# EAGLE design circuitPendulumLEDs (EAGLE 6.6.0)
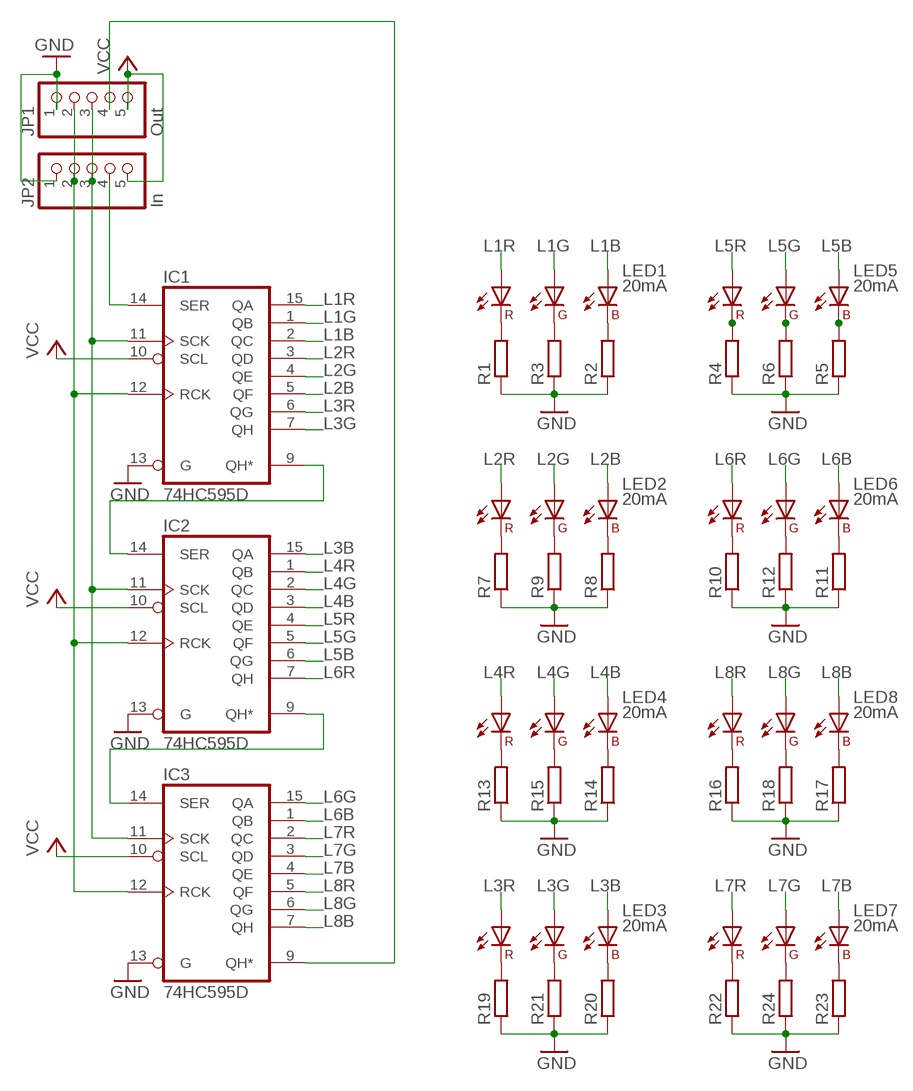
[diagram p0: schematic, sheet 1]

## Parts
IC1  74HC595D  [SO16]
IC2  74HC595D  [SO16]
IC3  74HC595D  [SO16]
JP1  Out  PINHD-1X55X2MM  [1_05X2MM]
JP2  In  PINHD-1X55X2MM  [1_05X2MM]
LED1  20mA  PLCC-6-RGB-SAMSUNG  [PLCC-6_SAMSUNG]
LED2  20mA  PLCC-6-RGB-SAMSUNG  [PLCC-6_SAMSUNG]
LED3  20mA  PLCC-6-RGB-SAMSUNG  [PLCC-6_SAMSUNG]
LED4  20mA  PLCC-6-RGB-SAMSUNG  [PLCC-6_SAMSUNG]
LED5  20mA  PLCC-6-RGB-SAMSUNG  [PLCC-6_SAMSUNG]
LED6  20mA  PLCC-6-RGB-SAMSUNG  [PLCC-6_SAMSUNG]
LED7  20mA  PLCC-6-RGB-SAMSUNG  [PLCC-6_SAMSUNG]
LED8  20mA  PLCC-6-RGB-SAMSUNG  [PLCC-6_SAMSUNG]
R1  R-EU_R0603  [R0603]
R2  R-EU_R0603  [R0603]
R3  R-EU_R0603  [R0603]
R4  R-EU_R0603  [R0603]
R5  R-EU_R0603  [R0603]
R6  R-EU_R0603  [R0603]
R7  R-EU_R0603  [R0603]
R8  R-EU_R0603  [R0603]
R9  R-EU_R0603  [R0603]
R10  R-EU_R0603  [R0603]
R11  R-EU_R0603  [R0603]
R12  R-EU_R0603  [R0603]
R13  R-EU_R0603  [R0603]
R14  R-EU_R0603  [R0603]
R15  R-EU_R0603  [R0603]
R16  R-EU_R0603  [R0603]
R17  R-EU_R0603  [R0603]
R18  R-EU_R0603  [R0603]
R19  R-EU_R0603  [R0603]
R20  R-EU_R0603  [R0603]
R21  R-EU_R0603  [R0603]
R22  R-EU_R0603  [R0603]
R23  R-EU_R0603  [R0603]
R24  R-EU_R0603  [R0603]

## Nets
GND: IC1.13(G) IC2.13(G) IC3.13(G) JP1.1 JP2.1 R1.1 R2.1 R3.1 R4.1 R5.1 R6.1 R7.1 R8.1 R9.1 R10.1 R11.1 R12.1 R13.1 R14.1 R15.1 R16.1 R17.1 R18.1 R19.1 R20.1 R21.1 R22.1 R23.1 R24.1
L1B: IC1.2(QC) LED1.3(AB)
L1G: IC1.1(QB) LED1.2(AG)
L1R: IC1.15(QA) LED1.1(AR)
L2B: IC1.5(QF) LED2.3(AB)
L2G: IC1.4(QE) LED2.2(AG)
L2R: IC1.3(QD) LED2.1(AR)
L3B: IC2.15(QA) LED3.3(AB)
L3G: IC1.7(QH) LED3.2(AG)
L3R: IC1.6(QG) LED3.1(AR)
L4B: IC2.3(QD) LED4.3(AB)
L4G: IC2.2(QC) LED4.2(AG)
L4R: IC2.1(QB) LED4.1(AR)
L5B: IC2.6(QG) LED5.3(AB)
L5G: IC2.5(QF) LED5.2(AG)
L5R: IC2.4(QE) LED5.1(AR)
L6B: IC3.1(QB) LED6.3(AB)
L6G: IC3.15(QA) LED6.2(AG)
L6R: IC2.7(QH) LED6.1(AR)
L7B: IC3.4(QE) LED7.3(AB)
L7G: IC3.3(QD) LED7.2(AG)
L7R: IC3.2(QC) LED7.1(AR)
L8B: IC3.7(QH) LED8.3(AB)
L8G: IC3.6(QG) LED8.2(AG)
L8R: IC3.5(QF) LED8.1(AR)
N$2: LED1.4(CR) R1.2
N$3: LED1.6(CB) R2.2
N$4: LED1.5(CG) R3.2
N$5: LED5.4(CR) R4.2
N$6: LED5.6(CB) R5.2
N$7: LED5.5(CG) R6.2
N$8: LED4.4(CR) R13.2
N$9: IC1.9(QH*) IC2.14(SER)
N$10: LED4.6(CB) R14.2
N$11: LED4.5(CG) R15.2
N$12: LED8.4(CR) R16.2
N$13: LED8.6(CB) R17.2
N$14: IC1.14(SER) JP2.4
N$15: IC2.9(QH*) IC3.14(SER)
N$16: LED8.5(CG) R18.2
N$17: LED6.4(CR) R10.2
N$18: LED6.6(CB) R11.2
N$19: LED6.5(CG) R12.2
N$20: LED2.4(CR) R7.2
N$21: IC3.9(QH*) JP1.4
N$22: LED2.6(CB) R8.2
N$23: IC1.12(RCK) IC2.12(RCK) IC3.12(RCK) JP1.2 JP2.2
N$24: LED2.5(CG) R9.2
N$25: IC1.11(SCK) IC2.11(SCK) IC3.11(SCK) JP1.3 JP2.3
N$26: LED3.4(CR) R19.2
N$27: LED3.6(CB) R20.2
N$28: LED3.5(CG) R21.2
N$29: LED7.4(CR) R22.2
N$30: LED7.6(CB) R23.2
N$31: LED7.5(CG) R24.2
VCC: IC1.10(SCL) IC2.10(SCL) IC3.10(SCL) JP1.5 JP2.5

## Power pins joined to a net without a drawn wire
GND: IC1.8(GND) IC2.8(GND) IC3.8(GND)
VCC: IC1.16(VCC) IC2.16(VCC) IC3.16(VCC)

## Library data of the parts
IC1-IC3 = 74xx-eu:74*595: 8-bit SHIFT REGISTER, output latch
JP1 JP2 = pinhead:PINHD-1X5: PIN HEADER
LED1-LED8 = LED-Samsung-RGB:PLCC-6-RGB-SAMSUNG
R1-R24 = resistor:R-EU_: RESISTOR, European symbol

## Board
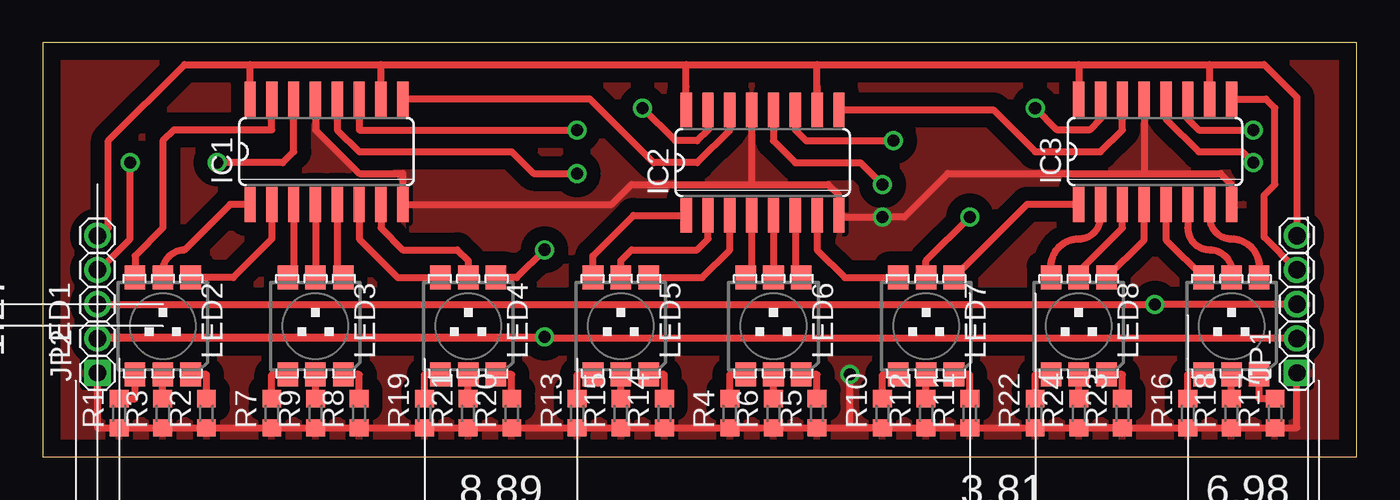
[diagram p1: board, top side]
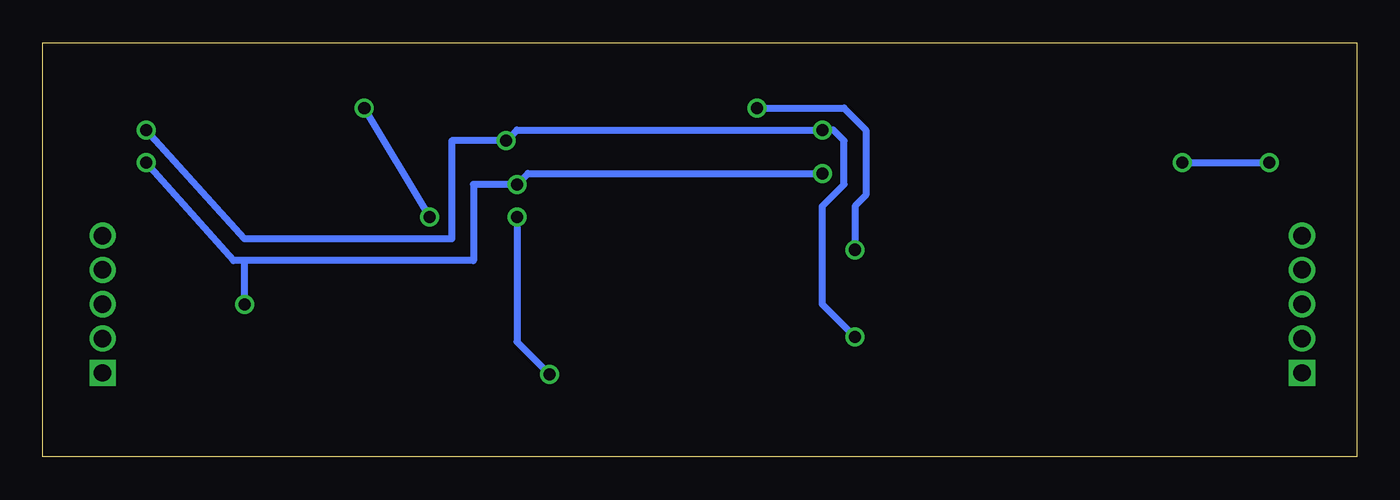
[diagram p2: board, bottom side, seen from below]

Size 76.51 x 24.12 mm. Coordinates in mm from the lower left corner, seen from the top.
Outline: 0,0 76.51,0 76.51,24.12 0,24.12 0,0
Copper layers (1*16): Top 0.035mm / dielectric 1.5mm / Bottom 0.035mm
Design rules "default": minimum track width 10mil, minimum drill 24mil, track to track 8mil, track to pad 8mil, pad to pad 8mil, via to via 8mil, smd to smd 8mil, copper to edge 40mil, drill to drill 8mil, minimum pad ring 10mil, minimum via ring 8mil, stop-mask expansion 4mil, vias tented up to drill 0mil, thermal gap 10mil

### Footprints (pad centres in the part's own frame; a part is rotated, then mirrored left to right if it is on the bottom)
SO16 = smd 0.66 x 2.032: 1 -4.445,-3.073; 2 -3.175,-3.073; 3 -1.905,-3.073; 4 -0.635,-3.073; 5 0.635,-3.073; 6 1.905,-3.073; 7 3.175,-3.073; 8 4.445,-3.073; 9 4.445,3.073; 10 3.175,3.073; 11 1.905,3.073; 12 0.635,3.073; 13 -0.635,3.073; 14 -1.905,3.073; 15 -3.175,3.073; 16 -4.445,3.073
1_05X2MM = drill 1.016 pad 1.3 square: 1 -4,0 | drill 1.016 pad 1.3: 2 0,0; 3 -2,0; 4 2,0; 5 4,0
PLCC-6_SAMSUNG = smd 1.2 x 1.4: 1 -1.619,2.826; 2 0,2.826; 3 1.619,2.826; 4 -1.619,-2.826; 5 0,-2.826; 6 1.619,-2.826
R0603 = smd 1 x 1.1: 1 -0.85,0; 2 0.85,0

### Placement (x,y rotation side)
IC1  16.51,17.78 0 top
IC2  41.91,17.15 0 top
IC3  64.77,17.78 0 top
JP1  73.03,8.89 90 top
JP2  3.17,8.89 90 top
LED1  6.98,7.62 0 top
LED2  15.88,7.62 0 top
LED3  24.77,7.62 0 top
LED4  33.66,7.62 0 top
LED5  42.54,7.62 0 top
LED6  51.43,7.62 0 top
LED7  60.32,7.62 0 top
LED8  69.22,7.62 0 top
R1  4.45,2.54 90 top
R2  9.53,2.54 90 top
R3  6.98,2.54 90 top
R4  40,2.54 90 top
R5  45.09,2.54 90 top
R6  42.54,2.54 90 top
R7  13.33,2.54 90 top
R8  18.42,2.54 90 top
R9  15.88,2.54 90 top
R10  48.89,2.54 90 top
R11  53.98,2.54 90 top
R12  51.43,2.54 90 top
R13  31.12,2.54 90 top
R14  36.2,2.54 90 top
R15  33.66,2.54 90 top
R16  66.68,2.54 90 top
R17  71.76,2.54 90 top
R18  69.22,2.54 90 top
R19  22.23,2.54 90 top
R20  27.31,2.54 90 top
R21  24.77,2.54 90 top
R22  57.78,2.54 90 top
R23  62.86,2.54 90 top
R24  60.32,2.54 90 top

### Tracks (layer width: path | path; a pad name or v marks a point on that pad's centre or on a via)
GND  (via drill 0.7)
  Top 0.406: IC1.13 15.88,19.05 18.42,16.51 20.96,16.51 IC1.8 33.12,14.71 34.29,15.88 41.27,15.88 | 41.27,15.88 45.72,15.88 46.35,15.24 IC2.8 46.35,13.97 v48.89,13.97 50.16,13.97 52.7,16.51 64.14,16.51 | IC2.13 41.27,15.88 | IC3.13 64.14,16.51 | 64.14,16.51 68.58,16.51 69.22,15.88 IC3.8 | JP2.1 3.17,1.69 R1.1 | R1.1 R3.1 R2.1 | R1.1 R7.1 R9.1 R8.1 R19.1 R21.1 R20.1 R13.1 R15.1 R14.1 R4.1 R6.1 R5.1 R10.1 | R10.1 46.99,1.69 v46.99,4.79 | R10.1 R12.1 R11.1 R22.1 R23.1 R24.1 R16.1 R18.1 R17.1 73.03,1.69 JP1.1
  Bottom 0.406: v48.89,13.97 48.89,6.7 v46.99,4.79
  pour Top (isolate 0.813): -1.91,26.04 -1.91,-1.91 79.38,-1.91 79.38,26.04
L1B
  Top 0.406: IC1.2 13.33,12.7 11.08,10.45 LED1.3
L1G
  Top 0.406: IC1.1 10.9,14.71 8.26,12.06 arc90 6.98,10.79 LED1.2
L1R
  Top 0.406: IC1.15 13.33,19.05 7.62,19.05 6.98,18.42 6.98,13.33 5.37,11.72 LED1.1
L2B
  Top 0.406: IC1.5 17.15,10.79 LED2.3
L2G
  Top 0.406: IC1.4 LED2.2
L2R
  Top 0.406: IC1.3 14.61,10.79 LED2.1
L3B  (via drill 0.7)
  Top 0.406: IC2.15 38.73,19.05 38.1,18.42 36.83,18.42 v34.92,20.32 | v29.21,12.06 27.59,10.45 LED3.3
  Bottom 0.406: v29.21,12.06 29.21,14.61 28.58,15.24 28.58,19.05 29.85,20.32 v34.92,20.32
L3G
  Top 0.406: IC1.7 19.69,13.33 20.96,12.06 24.13,12.06 24.77,11.43 LED3.2
L3R
  Top 0.406: IC1.6 18.42,12.7 20.67,10.45 LED3.1
L4B
  Top 0.406: LED4.3 38.39,10.45 40,12.06 IC2.3
L4G
  Top 0.406: LED4.2 33.66,11.43 34.29,12.06 38.1,12.06 38.73,12.7 IC2.2
L4R
  Top 0.406: LED4.1 32.04,11.72 34.39,14.07 IC2.1
L5B
  Top 0.406: IC2.6 43.81,10.45 LED5.3
L5G
  Top 0.406: IC2.5 LED5.2
L5R
  Top 0.406: IC2.4 41.27,10.45 LED5.1
L6B
  Top 0.406: IC3.1 57.31,14.71 LED6.3
L6G  (via drill 0.7)
  Top 0.406: IC3.15 61.59,19.69 60.96,19.05 59.05,19.05 v57.78,20.32 | LED6.2 51.43,11.43 v53.98,13.97
  Bottom 0.406: v57.78,20.32 v53.98,13.97
L6R
  Top 0.406: IC2.7 45.09,12.06 46.7,10.45 LED6.1
L7B
  Top 0.406: LED7.3 64.14,12.64 IC3.4
L7G
  Top 0.406: LED7.2 60.32,10.79 62.86,13.33 IC3.3
L7R
  Top 0.406: LED7.1 58.71,11.08 arc-90 60.32,12.7 arc90 61.59,13.97 IC3.2
L8B
  Top 0.406: IC3.7 67.95,13.97 arc90 69.22,12.7 arc-90 70.83,11.08 LED8.3
L8G
  Top 0.406: IC3.6 66.68,13.33 arc90 67.95,12.06 arc-104 LED8.2 69.22,10.79
L8R
  Top 0.406: IC3.5 65.41,12.64 LED8.1
N$1
  pour Top (isolate 0.813): -0.64,24.77 77.47,24.77 77.47,-0.64 -0.64,-0.64
N$2
  Top 0.406: R1.2 5.37,3.39 LED1.4
N$3
  Top 0.406: R2.2 9.53,4.79 LED1.6
N$4
  Top 0.406: R3.2 LED1.5
N$5
  Top 0.406: R4.2 40,4.79 LED5.4
N$6
  Top 0.406: R5.2 45.09,4.79 LED5.6
N$7
  Top 0.406: R6.2 LED5.5
N$8
  Top 0.406: R13.2 31.12,4.79 LED4.4
N$9
  Top 0.406: IC2.14 40,19.05 38.1,17.15 35.56,17.15 31.85,20.85 IC1.9
N$10
  Top 0.406: R14.2 36.2,4.79 LED4.6
N$11
  Top 0.406: R15.2 LED4.5
N$12
  Top 0.406: R16.2 66.68,4.79 LED8.4
N$13
  Top 0.406: R17.2 70.83,3.39 LED8.6
N$14  (via drill 0.7)
  Top 0.406: v5.08,17.15 5.08,12.7 3.27,10.89 JP2.4 | v10.16,17.15 13.97,17.15 14.61,17.78 IC1.14
  Bottom 0.406: v10.16,17.15 v5.08,17.15
N$15
  Top 0.406: IC2.9 55.35,20.22 57.78,17.78 61.59,17.78 62.86,19.05 IC3.14
N$16
  Top 0.406: R18.2 LED8.5
N$17
  Top 0.406: R10.2 48.89,4.79 LED6.4
N$18
  Top 0.406: R11.2 53.98,4.79 LED6.6
N$19
  Top 0.406: R12.2 LED6.5
N$20
  Top 0.406: R7.2 13.33,4.79 LED2.4
N$21
  Top 0.406: IC3.9 71.22,20.85 71.76,20.32 71.76,15.88 71.12,15.24 71.12,12.79 JP1.4
N$22
  Top 0.406: R8.2 18.42,4.79 LED2.6
N$23  (via drill 0.7)
  Top 0.406: IC1.12 17.15,19.05 18.42,17.78 27.31,17.78 28.58,16.51 v31.12,16.51 | IC2.12 42.54,18.42 43.81,17.15 47.62,17.15 v48.89,15.88 | IC3.12 65.41,19.69 67.31,17.78 69.85,17.78 v70.48,17.15 | JP2.2 v64.77,8.89 JP1.2
  Bottom 0.406: v31.12,16.51 48.26,16.51 v48.89,15.88 51.43,15.88 51.43,11.43 64.77,11.43 | v70.48,17.15 65.41,11.43 64.77,11.43 | v64.77,8.89 64.77,11.43
N$24
  Top 0.406: R9.2 LED2.5
N$25  (via drill 0.7)
  Top 0.406: IC1.11 18.42,19.05 v31.12,19.05 | IC2.11 43.81,19.05 44.45,18.42 v49.53,18.42 | IC3.11 66.68,19.69 67.31,19.05 v70.48,19.05 | JP1.3 JP2.3 2.63,6.98 v29.21,6.98
  Bottom 0.406: v70.48,19.05 64.77,12.7 52.7,12.7 52.7,18.42 v49.53,18.42 48.89,19.05 v31.12,19.05 30.48,19.05 29.85,18.42 29.85,15.88 31.12,14.61 31.12,8.89 v29.21,6.98
N$26
  Top 0.406: R19.2 22.23,4.79 LED3.4
N$27
  Top 0.406: R20.2 27.31,4.79 LED3.6
N$28
  Top 0.406: R21.2 LED3.5
N$29
  Top 0.406: R22.2 57.78,4.79 LED7.4
N$30
  Top 0.406: R23.2 62.86,4.79 LED7.6
N$31
  Top 0.406: R24.2 LED7.5
VCC
  Top 0.406: IC1.16 12.06,22.86 | IC1.10 19.69,22.86 | 37.46,21.59 IC2.16 37.46,22.86 | 45.09,21.59 IC2.10 45.09,22.86 | 60.32,22.86 IC3.16 | 19.69,22.86 37.46,22.86 | 37.46,22.86 45.09,22.86 | 45.09,22.86 60.32,22.86 | 60.32,22.86 67.95,22.86 | 12.06,22.86 19.69,22.86 | IC3.10 67.95,22.86 | 67.95,22.86 71.12,22.86 73.03,20.96 JP1.5 | JP2.5 3.81,13.33 3.81,18.42 8.26,22.86 12.06,22.86